# EAGLE design lionpuffer-04 (EAGLE 6.2)
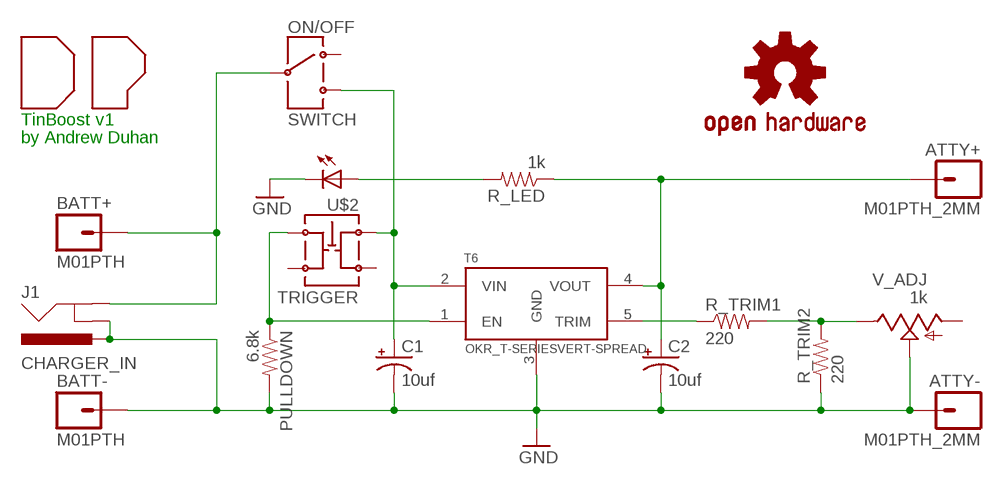
[diagram p0: schematic, sheet 1]

## Parts
ATTY+  M01PTH_2MM  [1X01_2MM]
ATTY-  M01PTH_2MM  [1X01_2MM]
BATT+  M01PTH  [1X01]
BATT-  M01PTH  [1X01]
C1  10uf  CAP_POLPTH2  [CPOL-RADIAL-10UF-25V]
C2  10uf  CAP_POLPTH2  [CPOL-RADIAL-10UF-25V]
J1  CHARGER_IN  POWER_JACKPTH  [POWER_JACK_PTH]
ON/OFF  SWITCH  SWITCH-SPSTCK-1101  [SWITCH-CK1101]
PULLDOWN  6.8k  RESISTORPTH-1/6W  [1/6W-RES]
R_LED  1k  RESISTORPTH-1/6W  [1/6W-RES]
R_TRIM1  220  RESISTORPTH-1/6W  [1/6W-RES]
R_TRIM2  220  RESISTORPTH-1/6W  [1/6W-RES]
T6  OKR_T-SERIESVERT-SPREAD  [OKR-T/6_10-VERT-SPACED]
U$1  OSHW-LOGOM  [OSHW-LOGO-M]
U$2  TRIGGER  SWITCH-TACT-ILL  [E-SWITCH_TL1250]
U$3  DP_LOGO  [DP_LOGO]
V_ADJ  1k  POT3310Y-001  [POT-TOP-BOURNS]

## Nets
ATTY+: ATTY+.1 C2.1(+) R_LED.1 T6.4(VOUT)
BATT+: BATT+.1 J1.GND ON/OFF.2
GND: ATTY-.1 BATT-.1 C1.2(-) C2.2(-) J1.GNDBREAK J1.PWR PULLDOWN.2 R_TRIM2.1 T6.3(GND) U$2.5(C) V_ADJ.2(W)
N$1: R_TRIM1.2 R_TRIM2.2 V_ADJ.3(B)
N$2: PULLDOWN.1 T6.1(EN) U$2.3
N$3: R_TRIM1.1 T6.5(TRIM)
N$4: R_LED.2 U$2.6(A)
VIN: C1.1(+) ON/OFF.3 T6.2(VIN) U$2.1
Unconnected: ON/OFF.1 U$2.2 U$2.4 V_ADJ.1(A)

## Notes on the sheet
- TinBoost v1
- by Andrew Duhan

## Library data of the parts
ATTY+ ATTY- = SparkFun-Connectors:M01: Header 1 Standard 1-pin 0.1" header. Use with straight break away headers (SKU : PRT-00116), right angle break away headers (PRT-00553), swiss pins (PRT-00743), machine pins (PRT-00117), and female headers (PRT-00115).
BATT+ BATT- = SparkFun:M01: Header 1 Standard 1-pin 0.1" header. Use with straight break away headers (SKU : PRT-00116), right angle break away headers (PRT-00553), swiss pins (PRT-00743), machine pins (PRT-00117), and female headers (PRT-00115).
C1 C2 = SparkFun-Passives:CAP_POL: Capacitor Polarized These are standard SMD and PTH capacitors. Normally 10uF, 47uF, and 100uF in electrolytic and tantalum varieties. Always verify the external diameter of the through hole cap, it varies with capacity, voltage, and manufacturer. The EIA devices should be standard.
J1 = SparkFun:POWER_JACK: Power Jack This is the standard 5.5mm barrel jack for power. The PTH is the most common, proven, reliable, footprint. All others are experimental. The Slot footprint only works if the mill layer is transmitted to the PCB fab house so be warned. Spark Fun Electronics SKU : PRT-00119. Mating wall wart : TOL-00298 (and others)
ON/OFF = myparts:SWITCH-SPST
PULLDOWN R_LED R_TRIM1 R_TRIM2 = SparkFun-Passives:RESISTOR: Resistor Basic schematic elements and footprints for 0603, 1206, and PTH resistors.
T6 = myparts:OKR_T-SERIES
U$1 = SparkFun-Aesthetics:OSHW-LOGO: Open Source Hardware Logo This logo indicates the piece of hardware it is found on incorporates a OSHW license and/or adheres to the definition of open source hardware found here: http://freedomdefined.org/OSHW
U$2 = myparts:SWITCH-TACT-ILL
U$3 = myparts:DP_LOGO: Duhan Power! logo
V_ADJ = myparts:POT

## Board
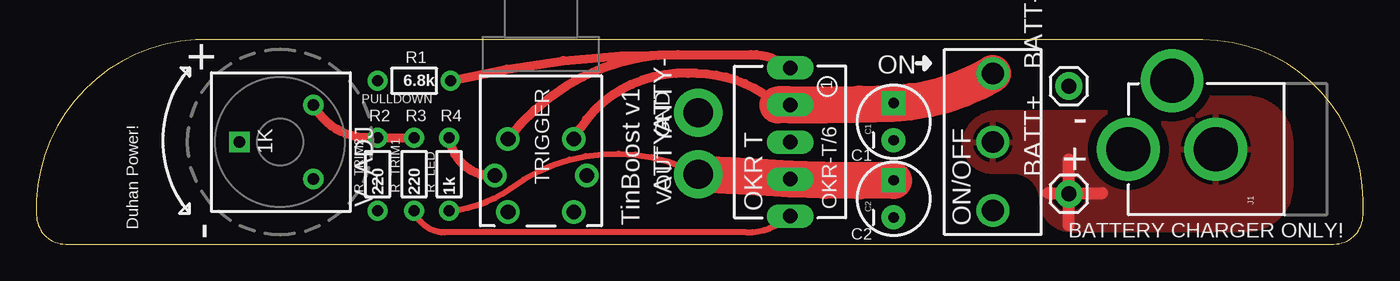
[diagram p1: board, top side]
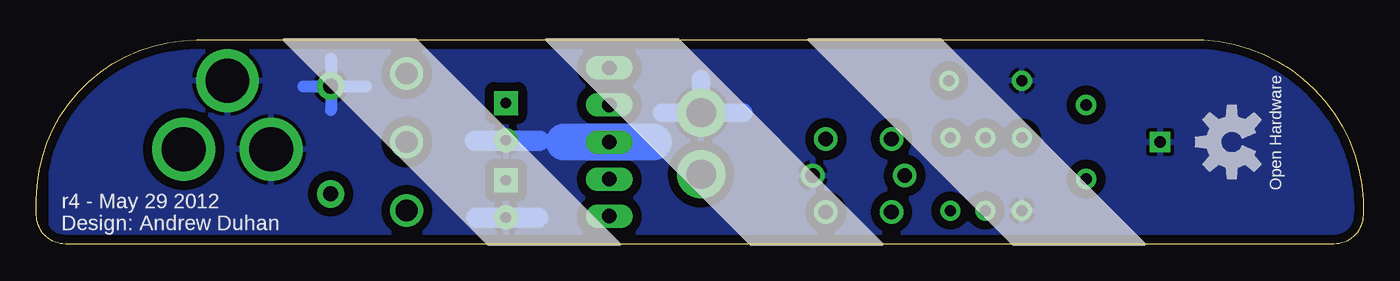
[diagram p2: board, bottom side, seen from below]

Size 91 x 14 mm. Coordinates in mm from the lower left corner, seen from the top.
Outline: 91,2 91,3 arc90 80,14 12,14 arc90 0,3 0,2 arc90 2,0 89,0 arc90 91,2
Copper layers (1*16): Top 0.035mm / dielectric 1.5mm / Bottom 0.035mm
Design rules: minimum track width 8mil, minimum drill 20mil, track to track 8mil, track to pad 8mil, pad to pad 8mil, via to via 8mil, smd to smd 8mil, copper to edge 10mil, drill to drill 8mil, minimum pad ring 12mil, minimum via ring 10mil, stop-mask expansion 4mil, vias tented up to drill 25mil, thermal gap 10mil

### Footprints (pad centres in the part's own frame; a part is rotated, then mirrored left to right if it is on the bottom)
1X01_2MM = drill 2 pad 3.302: 1 0,0
1X01 = drill 1.016 pad 1.88: 1 0,0
CPOL-RADIAL-10UF-25V = drill 0.7 pad 1.651 square: 1 1.27,0 | drill 0.7 pad 1.651: 2 -1.27,0
POWER_JACK_PTH = drill 2.997 pad 4.318: GND 0,7.7; GNDBREAK 4.7,10.7; PWR 0,13.7
SWITCH-CK1101 = drill 1.5: 1 0,-4.699; 2 0,0; 3 0,4.699
1/6W-RES = drill 0.762: 1 -2.5,0; 2 2.5,0
OKR-T/6_10-VERT-SPACED = drill 1 long: 1 5.08,0; 2 2.54,0; 3 0,0; 4 -2.54,0; 5 -5.08,0
E-SWITCH_TL1250 = drill 1: 1 -2.25,-2.5; 2 -2.25,2.5; 3 2.25,-2.5; 4 2.25,2.5; 5 -3.15,0; 6 3.15,0
POT-TOP-BOURNS = drill 0.8: 1 -2.54,0; 3 2.54,0 | drill 0.8 square: 2 0,5.08

### Placement (x,y rotation side)
ATTY+  45.4,4.8 90 top
ATTY-  45.4,9 90 top
BATT+  70.82,3.45 90 top
BATT-  70.82,10.83 90 top
C1  58.8,8.4 90 top
C2  58.8,3.1 90 top
J1  88.6,6.5 90 top
ON/OFF  65.6,7 0 top
PULLDOWN  25.9,11.2 180 top
R_LED  28.3,4.8 90 top
R_TRIM1  25.9,4.8 90 top
R_TRIM2  23.4,4.8 90 top
T6  51.7,7 90 top
U$1  9,7 90 bottom
U$2  34.6,4.7 180 top
U$3  3.63,4.7 90 top
V_ADJ  19,7 90 top

### Tracks (layer width: path | path; a pad name or v marks a point on that pad's centre or on a via)
ATTY+
  Top 0.406: R_LED.1 arc32 32.5,3.8 arc-65 ATTY+.1
  Top 2.54: C2.1 arc-4 T6.4 arc0 ATTY+.1
BATT+
  Top 0.813: 70.8,5.8 70.8,1.3 | 69.4,3.5 73.1,3.5
  pour Top (isolate 0.61): 65.8,5 arc-103 63.7,7.2 arc-82 66.2,9 79,9 80,10 83,10 arc-90 86,7 86,4 86,4 arc-90 83,1 71,1 71,1 arc-90 69,3 arc90 67,5 67,5
GND
  Bottom 0.813: 68.4,10.8 72.7,10.8 | 70.8,12.7 70.8,9.2
  Bottom 1.27: 42.5,9 ATTY-.1 | ATTY-.1 48.1,9 | ATTY-.1 45.4,11.3
  Bottom 1.422: 56.5,7.1 60.9,7.1 | 56.6,1.8 60.8,1.8
  Bottom 2.54: 48.7,7 54.8,7
  pour Bottom (isolate 0.61, rank 5): -2.1,-0.9 -2.1,15.1 90,15 90,-1
N$1
  Top 0.61: R_TRIM1.2 R_TRIM2.2 22.34,7.3 arc-56 V_ADJ.3
N$2
  Top 0.61: 44,13 49,13 arc-38 T6.1 | 44,13 arc53 U$2.3 | PULLDOWN.1 arc-14 44,13
N$3
  Top 0.406: T6.5 arc-41 48.7,0.8 28,0.8 arc-71 R_TRIM1.1
N$4
  Top 0.61: R_LED.2 28.4,6.9 arc78 U$2.6
VIN
  Top 0.61: 50.84,9.54 arc43 45.3,11.7 44.7,11.7 arc65 U$2.1
  Top 2.54: 50.84,9.54 T6.2 arc2 C1.1 arc29 ON/OFF.3

### Text on the board
tPlace: + | R1 | ON | GND | 1 | - | R2 | R3 | R4 | VOUT | + | 1K | C1 | TRIGGER | OKR-T/6 | Duhan Power! | TinBoost v1 | C2 | - | BATTERY CHARGER ONLY!
bPlace: Open Hardware | r4 - May 29 2012 | Design: Andrew Duhan